# EAGLE design hv_transformer_body (EAGLE 7.2.0)
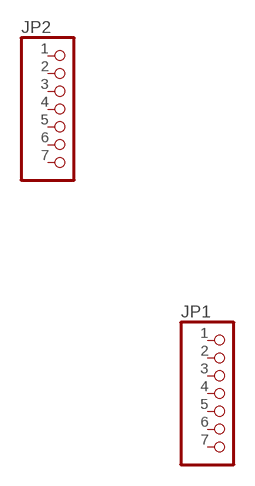
[diagram p0: schematic, sheet 1]

## Parts
JP1  PINHD-1X07_2.54  [1X07]
JP2  PINHD-1X07_2.54  [1X07]
Unconnected: JP1.1 JP1.2 JP1.3 JP1.4 JP1.5 JP1.6 JP1.7 JP2.1 JP2.2 JP2.3 JP2.4 JP2.5 JP2.6 JP2.7

## Library data of the parts
JP1 JP2 = pinhead-2:PINHD-1X07: PIN HEADER

## Board
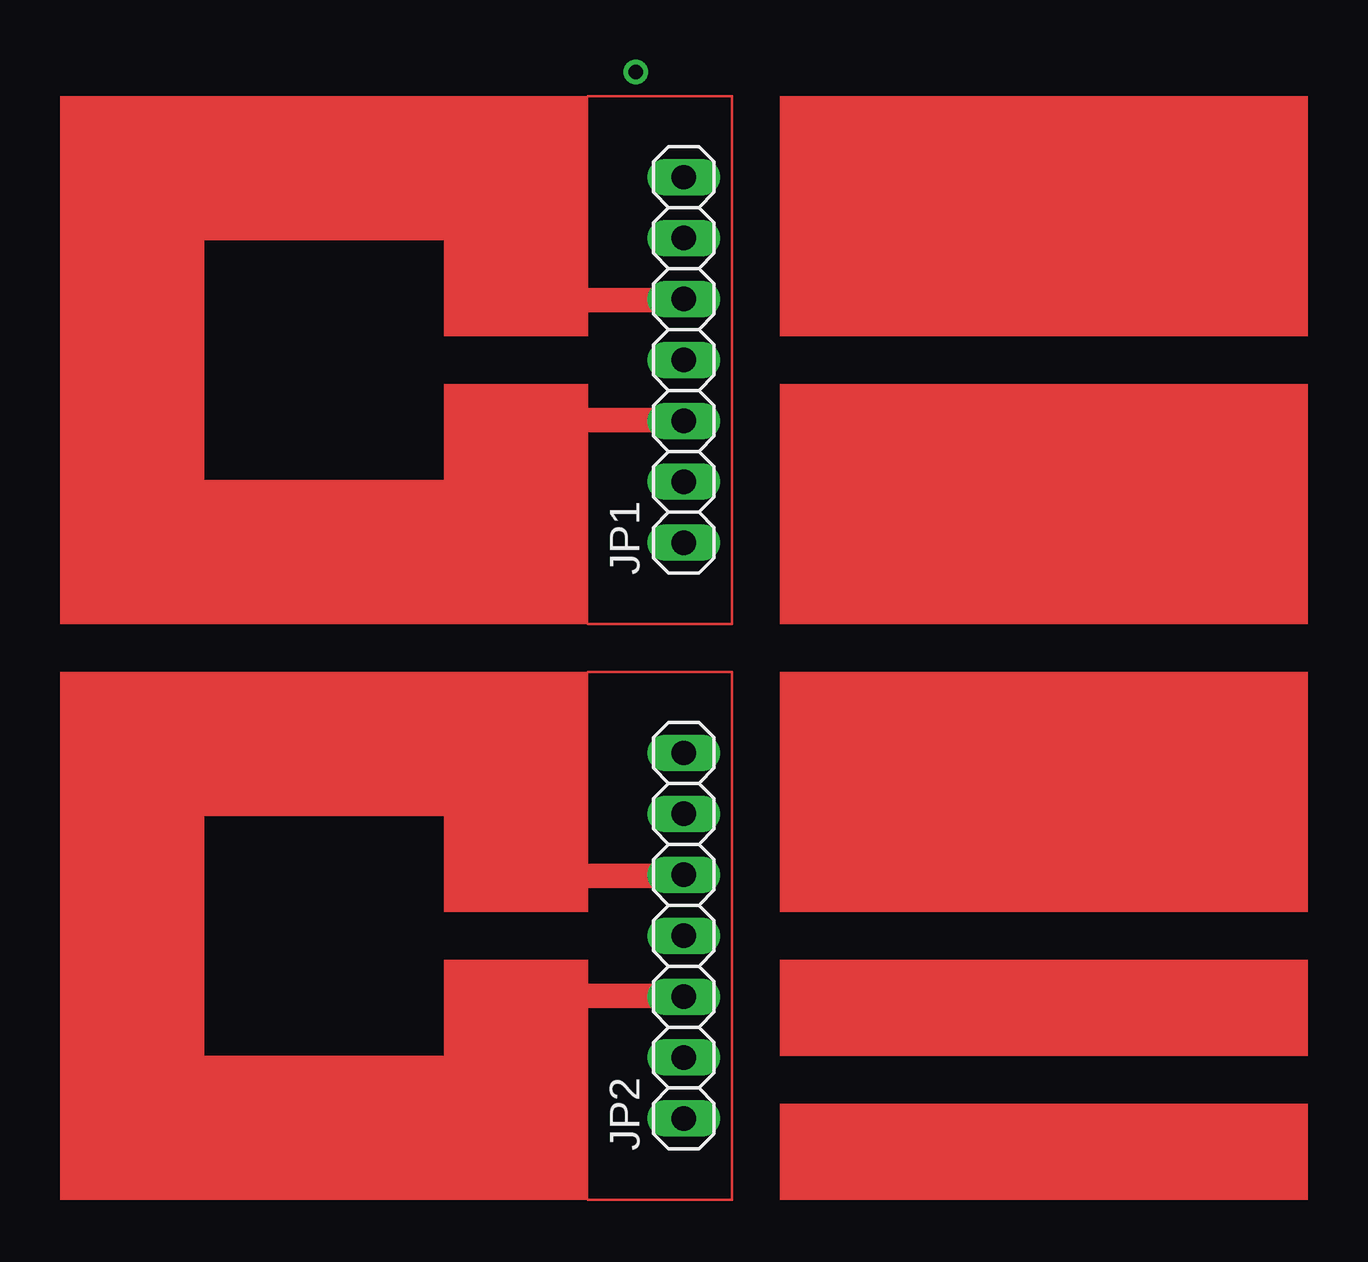
[diagram p1: board, top side]

No outline drawn. Coordinates in mm, seen from the top.
Copper layers (1*16): Top 0.035mm / dielectric 1.5mm / Bottom 0.035mm
Design rules "default": minimum track width 0.2mm, minimum drill 0.2mm, track to track 0.2mm, track to pad 0.2mm, pad to pad 0.2mm, via to via 0.2mm, smd to smd 0.2mm, copper to edge 0.2mm, drill to drill 0.2mm, minimum pad ring 10mil, minimum via ring 8mil, stop-mask expansion 4mil, vias tented up to drill 0mil, thermal gap 10mil

### Footprints (pad centres in the part's own frame; a part is rotated, then mirrored left to right if it is on the bottom)
1X07 = drill 1.016 long: 1 -7.62,0; 2 -5.08,0; 3 -2.54,0; 4 0,0; 5 2.54,0; 6 5.08,0; 7 7.62,0

### Placement (x,y rotation side)
JP1  26,35 90 top
JP2  26,11 90 top

### Tracks (layer width: path | path; a pad name or v marks a point on that pad's centre or on a via)
N$1
  Top 0.1: 22,46 28,46 28,24 22,24
N$2
  Top 0.1: 22,22 28,22 28,0 22,0
N$3  (via drill 0.6)
  other vias: 24,47
(copper drawn outside any net)
  shapes: Top area x19